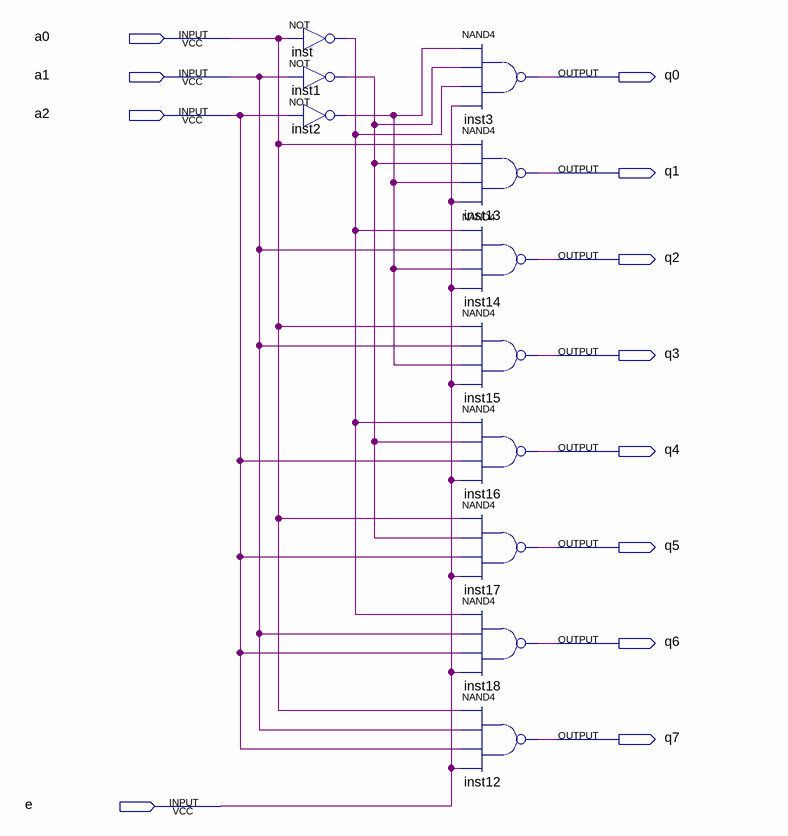
[diagram p0: schematic sheet]
// Quartus schematic point1.bdf as structural Verilog: 11 symbols, 12 pins
module point1 (
  input  a0,
  input  a1,
  input  a2,
  input  e,
  output q0,
  output q1,
  output q2,
  output q3,
  output q4,
  output q5,
  output q6,
  output q7
);

  wire inst1_out, inst2_out, inst_out;

  not inst (inst_out, a0);
  not inst1 (inst1_out, a1);
  not inst2 (inst2_out, a2);
  nand inst3 (q0, inst2_out, inst1_out, inst_out, e);
  nand inst13 (q1, a0, inst1_out, inst2_out, e);
  nand inst14 (q2, inst_out, a1, inst2_out, e);
  nand inst15 (q3, a0, a1, inst2_out, e);
  nand inst16 (q4, inst_out, inst1_out, a2, e);
  nand inst17 (q5, a0, inst1_out, a2, e);
  nand inst18 (q6, inst_out, a1, a2, e);
  nand inst12 (q7, a0, a1, a2, e);
endmodule
